# Altium schematic sheet KinetisDIP.SchDoc: Kinetis-DIP
size A4; Revision: 1.3
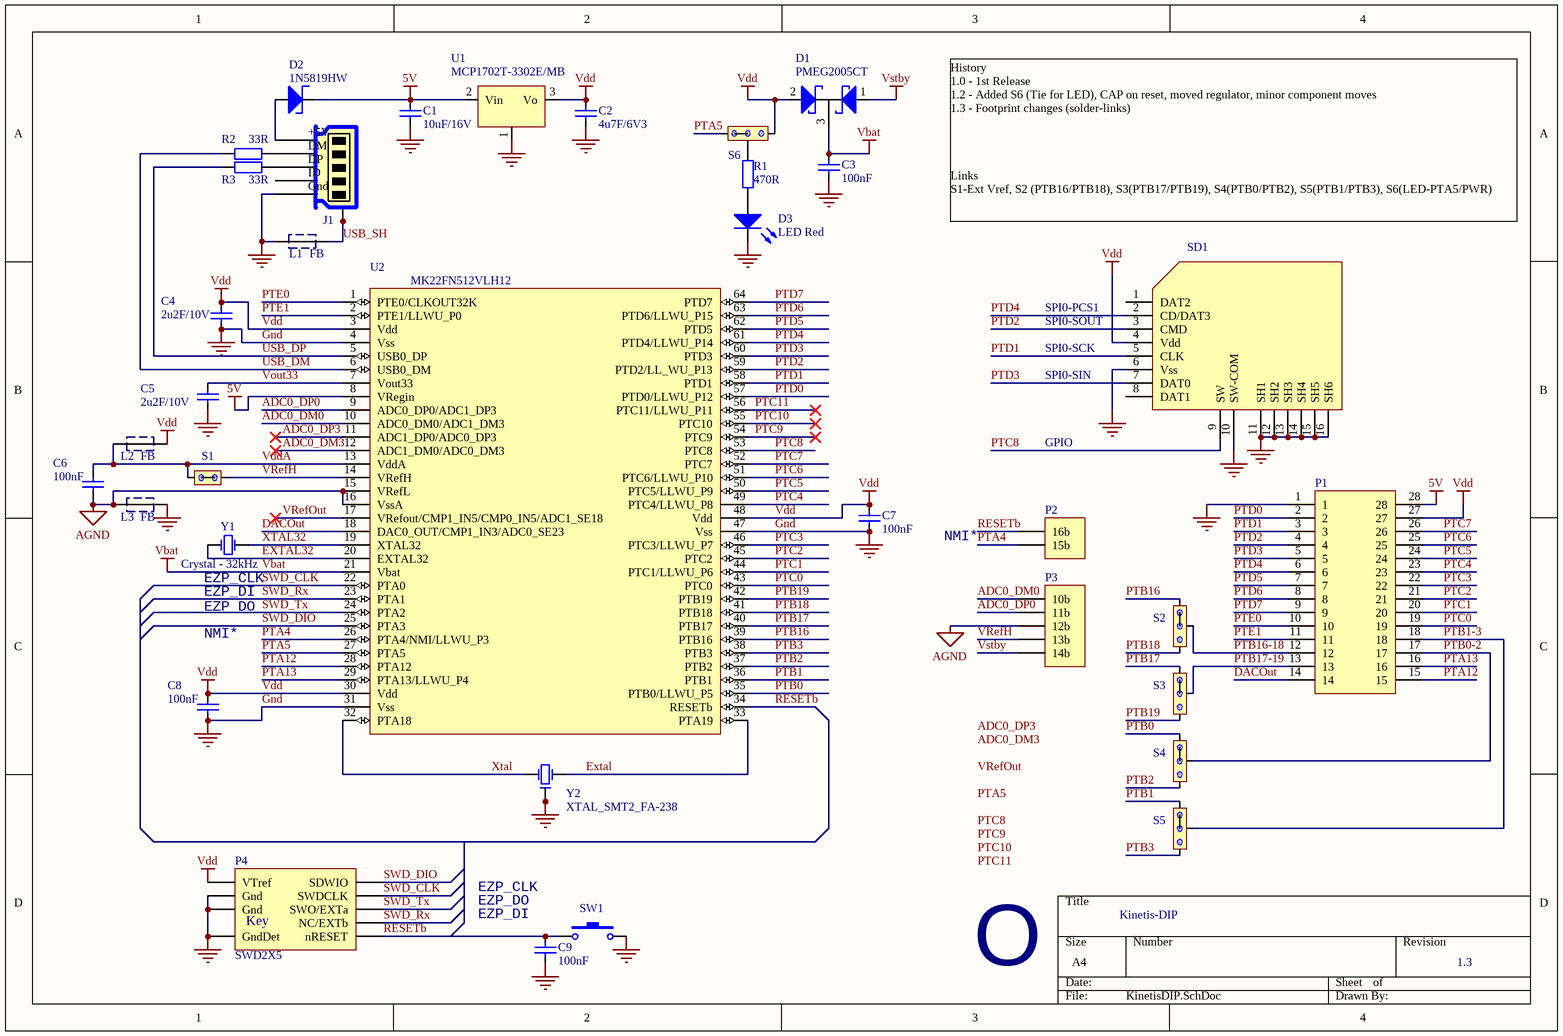
[diagram p0: KinetisDIP.SchDoc]

## Parts
C1  10uF/16V  [CCNP2012-0805]
C2  4u7F/6V3  [CCNP1608-0603]
C3  100nF  [CCNP1608-0603]
C4  2u2F/10V  [CCNP1608-0603]
C5  2u2F/10V  [CCNP1608-0603]
C6  100nF  [CCNP1608-0603]
C7  100nF  [CCNP1608-0603]
C8  100nF  [CCNP1608-0603]
C9  100nF  [CCNP1608-0603]
D1  PMEG2005CT  [SOT23]
D2  1N5819HW  [SOD-123]
D3  LED Red  [LED1608-0603-RED]
J1  USB_MICRO_B_CONNECTOR  [MOLEX - 47346-0001]  (value not drawn)
L1  FB  [CR1608-0603]
L2  FB  [CR1608-0603]
L3  FB  [CR1608-0603]
Logo  OSHW Logo  [OSHW]  (value not drawn)  (no BOM)
P1  WDIP-28-0.6  [WDIP-28-0.6]  (value not drawn)  (no BOM)
P2  Header 2  [HDR1X2]  (value not drawn)  (no BOM)
P3  Header 5  [HDR1X5]  (value not drawn)  (no BOM)
P4  SWD2X5  [SWD-2x5]
R1  470R  [CR1608-0603]
R2  33R  [CR1608-0603]
R3  33R  [CR1608-0603]
S1  LinkClosed  [SolderBridge(Closed)]  (value not drawn)  (net tie, no BOM)
S2  Link3Closed  [SolderBridge3(Closed)]  (value not drawn)  (net tie, no BOM)
S3  Link3Closed  [SolderBridge3(Closed)]  (value not drawn)  (net tie, no BOM)
S4  Link3Closed  [SolderBridge3(Closed)]  (value not drawn)  (net tie, no BOM)
S5  Link3Closed  [SolderBridge3(Closed)]  (value not drawn)  (net tie, no BOM)
S6  Link3Closed  [SolderBridge3(Closed)]  (value not drawn)  (net tie, no BOM)
SD1  SD_Socket2  [SDCARD_MICRO - MOLEX 504077-1891]  (value not drawn)
SW1  SW-PB-SMT-B3U  [SW_SMT_PB2-B3U]  (value not drawn)
U1  MCP1702T-3302E/MB  [SOT-89]
U2  MK22FN512VLH12  [TSQFP50P1200X1200-64N]
Y1  Crystal - 32kHz  [crystal_can]
Y2  XTAL_SMT2_FA-238  [Crystal_SMT - EPSON-FA-238]

## Nets
5V: C1.2 D2.2(K) P1.28 U1.2(Vin) U2.8(VRegin)
AGND: C6.2 L3.2 P3.3(12b) U2.15(VRefL) U2.16(VssA)
Gnd: C1.1 C2.2 C3.2 C4.1 C5.1 C7.2 C8.2 C9.2 D3.K J1.G(USBGnd) L1.1 L3.1 P1.1 P4.3(Gnd) P4.5(Gnd) P4.9(GndDet) SD1.6(Vss) SD1.10(SW-COM) SD1.11(SH1) SD1.12(SH2) SD1.13(SH3) SD1.14(SH4) SD1.15(SH5) SD1.16(SH6) SW1.2 U1.1(Gnd) U2.4(Vss) U2.31(Vss) U2.47(Vss) Y2.2(Gnd) Y2.4(Gnd)
Vbat: C3.1 D1.3(K) U2.21(Vbat)
Vdd: C2.1 C4.2 C7.1 C8.1 D1.2(A2) L2.1 P1.27 P4.1(VTref) S6.3 SD1.4(Vdd) U1.3(Vo) U2.3(Vdd) U2.30(Vdd) U2.48(Vdd)
Vstby: D1.1(A1) P3.5(14b)
ADC0_DM0: P3.1(10b) U2.10(ADC0_DM0/ADC1_DM3)
ADC0_DM3: U2.12(ADC1_DM0/ADC0_DM3)
ADC0_DP0: P3.2(11b) U2.9(ADC0_DP0/ADC1_DP3)
ADC0_DP3: U2.11(ADC1_DP0/ADC0_DP3)
DACOut: P1.14 U2.18(DAC0_OUT/CMP1_IN3/ADC0_SE23)
Extal: U2.33(PTA19) Y2.3(OSC2)
EXTAL32: U2.20(EXTAL32) Y1.2(OSC2)
PTA4: P2.2(15b) U2.26(PTA4/NMI/LLWU_P3)
PTA5: S6.1 U2.27(PTA5)
PTA12: P1.15 U2.28(PTA12)
PTA13: P1.16 U2.29(PTA13/LLWU_P4)
PTB0: S4.1 U2.35(PTB0/LLWU_P5)
PTB0-2: P1.17 S4.2
PTB1: S5.1 U2.36(PTB1)
PTB1-3: P1.18 S5.2
PTB2: S4.3 U2.37(PTB2)
PTB3: S5.3 U2.38(PTB3)
PTB16: S2.1 U2.39(PTB16)
PTB16-18: P1.12 S2.2
PTB17: S3.1 U2.40(PTB17)
PTB17-19: P1.13 S3.2
PTB18: S2.3 U2.41(PTB18)
PTB19: S3.3 U2.42(PTB19)
PTC0: P1.19 U2.43(PTC0)
PTC1: P1.20 U2.44(PTC1/LLWU_P6)
PTC2: P1.21 U2.45(PTC2)
PTC3: P1.22 U2.46(PTC3/LLWU_P7)
PTC4: P1.23 U2.49(PTC4/LLWU_P8)
PTC5: P1.24 U2.50(PTC5/LLWU_P9)
PTC6: P1.25 U2.51(PTC6/LLWU_P10)
PTC7: P1.26 U2.52(PTC7)
PTC8: SD1.9(SW) U2.53(PTC8)
PTC9: U2.54(PTC9)
PTC10: U2.55(PTC10)
PTC11: U2.56(PTC11/LLWU_P11)
PTD0: P1.2 U2.57(PTD0/LLWU_P12)
PTD1: P1.3 SD1.5(CLK) U2.58(PTD1)
PTD2: P1.4 SD1.3(CMD) U2.59(PTD2/LL_WU_P13)
PTD3: P1.5 SD1.7(DAT0) U2.60(PTD3)
PTD4: P1.6 SD1.2(CD/DAT3) U2.61(PTD4/LLWU_P14)
PTD5: P1.7 U2.62(PTD5)
PTD6: P1.8 U2.63(PTD6/LLWU_P15)
PTD7: P1.9 U2.64(PTD7)
PTE0: P1.10 U2.1(PTE0/CLKOUT32K)
PTE1: P1.11 U2.2(PTE1/LLWU_P0)
RESETb: C9.1 P2.1(16b) P4.10(nRESET) SW1.1 U2.34(RESETb)
SWD_CLK: P4.4(SWDCLK) U2.22(PTA0)
SWD_DIO: P4.2(SDWIO) U2.25(PTA3)
SWD_Rx: P4.8(NC/EXTb) U2.23(PTA1)
SWD_Tx: P4.6(SWO/EXTa) U2.24(PTA2)
USB_DM: R2.2 U2.6(USB0_DM)
USB_DP: R3.2 U2.5(USB0_DP)
USB_SH: J1.S1(USBShd) J1.S2(USBShd) J1.S3(USBShd) J1.S4(USBShd) J1.S5(USBShd) J1.S6(USBShd) L1.2
VddA: C6.1 L2.2 S1.1 U2.13(VddA)
Vout33: C5.2 U2.7(Vout33)
VRefH: P3.4(13b) S1.2 U2.14(VRefH)
VRefOut: U2.17(VRefout/CMP1_IN5/CMP0_IN5/ADC1_SE18)
Xtal: U2.32(PTA18) Y2.1(OSC1)
XTAL32: U2.19(XTAL32) Y1.1(OSC1)
NetD2_1: D2.1(A) J1.VBUS(USB+5v)
NetD3_A: D3.A R1.1
NetJ1_D+: J1.D+(USBDP) R3.1
NetJ1_D-: J1.D-(USBDM) R2.1
NetR1_2: R1.2 S6.2

Not connected (* = marked no-connect by the designer): J1 ID(USB_ID); SD1 1(DAT2) 8(DAT1)

## Notes on the sheet
- History
  1.0 - 1st Release
  1.2 - Added S6 (Tie for LED), CAP on reset, moved regulator, minor component moves
  1.3 - Footprint changes (solder-links)
  Links
  S1-Ext Vref, S2 (PTB16/PTB18), S3(PTB17/PTB19), S4(PTB0/PTB2), S5(PTB1/PTB3), S6(LED-PTA5/PWR)
- (near SD1) SPI0-PCS1
- (near SD1) SPI0-SOUT
- SPI0-SCK
- SPI0-SIN
- GPIO
- (near Y1) EZP_CLK
- NMI*
- (near Y1) EZP_DI
- EZP_DO
- EZP_CLK
- (near C9) EZP_DI
- Labels drawn without touching a wire or pin: ADC0_DM3, ADC0_DP3, PTA5, PTC8, PTC9, PTC10, PTC11, VRefOut
- (in symbol OSHW Logo) O
- (in symbol SWD2X5) Key
- (in symbol USB_MICRO_B_CONNECTOR) +5V; DM; DP; Gnd

## Library data of the parts
C1 = Cap_CCNP_0805: Capacitor SMT 0805; Manufacturer: Generic Components; Class: Passive; Published: 08/06/2000; Publisher: Altium Hobart Technology Centre; SubClass: Capacitor; Farnell PN: 2346934; Digikey: *; Value: 10uF/16V
C2 C3 C6-C9 = Cap_CCNP_0603: Capacitor SMT 0603; Manufacturer: Generic Components; Class: Passive; Published: 08/06/2000; Publisher: Altium Hobart Technology Centre; SubClass: Capacitor; Digikey: *
  C2: Farnell PN: 1907504; Value: 4u7F/6V3
  C3 C6-C9: Farnell PN: *; Value: 100nF
C4 C5 = Cap: Capacitor; Manufacturer: Generic Components; Class: Passive; Published: 08/06/2000; Publisher: Altium Hobart Technology Centre; SubClass: Capacitor; Farnell PN: 2496850; Digikey: *; Value: 2u2F/10V
D1 = PMEG2005CT: Dual Schottky Diode (SMT); Digikey: *; Farnell PN: 2459194
D2 = 1N5819HW: SCHOTTKY, 1A, 40V, SOD-123; Manufacturer: Generic Components; Class: Discrete; SubClass: Diode - Switching; Published: 08/06/2000; Publisher: Altium Hobart Technology Centre; Digikey: *; Farnell PN: 2306459
D3 = LED-0603-Red: LED 0603 Red; Manufacturer: Generic Components; Class I: Optoelectronic; Published: 8-Jun-2000; Revision: July-2002: Re-released for DXP Platform.; Publisher: Altium Limited; Class II: LED; Farnell PN: 5790852; Digikey: *
J1 = USB_MICRO_B_CONNECTOR: USB Micro-B Connector; Farnell PN: 1568026; Digikey: *
L1-L3 = Ferrite Bead_0603: Ferrite Bead (0603); Farnell PN: 1515717; Digikey: *
P1 = WDIP-28-0.6: Wide SIP package (0.6")
P2 = Header 2: Header, 2-Pin; LatestRevisionDate: 17-Jul-2002; LatestRevisionNote: Re-released for DXP Platform.; Publisher: Altium Limited
P3 = Header 5: Header, 5-Pin; LatestRevisionDate: 17-Jul-2002; LatestRevisionNote: Re-released for DXP Platform.; Publisher: Altium Limited
P4 = SWD2X5: SWD Connector 2x5-Pin; LatestRevisionDate: 17-Jul-2002; LatestRevisionNote: Re-released for DXP Platform.; Publisher: Altium Limited
R1 = Res: Resistor SMT; Manufacturer: Generic Components; Class: Passive; Published: 08/06/2000; Publisher: Altium Hobart Technology Centre; SubClass: Resistor; Value: 470R; Farnell PN: 1632490; Digikey: *
R2 R3 = Res: Resistor; Manufacturer: Generic Components; Class: Passive; Published: 08/06/2000; Publisher: Altium Hobart Technology Centre; SubClass: Resistor; Farnell PN: *; Digikey: *; Value: 33R
SD1 = SD_Socket2: MOLEX  5040771891  CONNECTOR, MICRO SD, 1.1MM, 8 POSITION; Farnell PN: 2214964
SW1 = SW-PB-SMT-B3U: Switch OMRON B3U series; Manufacturer: Generic Components; Published: 24-Mar-1999; Revision: July-2002: Re-released for DXP Platform.; Publisher: Altium Limited; Digikey: *; Farnell PN: 2500851
U1 = MCP1702T-3302E/MB: 3V3 LDO regulator; Farnell PN: 1605558
U2 = MK22FN512VLH12: Arm Cortex M4F; Supplier 1: Farnell; Supplier 2: Digi-Key; Supplier Part Number 1: 2434224; Supplier Part Number 2: MK22FN512VLH12-ND; Farnell PN: 2434224
Y1 = XTAL-32kHz_CITIZEN_CAN: CITIZEN CFS2016; Farnell PN: 1457084
Y2 = XTAL_SMT2_FA-238: Crystal (EPSON  Q22FA23800065 FA-238 24 MHZ 12.0PF); Manufacturer: Generic Components; Class: Oscillator; SubClass: Crystal Oscillator; Published: 08/06/2000; Publisher: Altium Hobart Technology Centre; Digikey: *; Farnell PN: 1712815